# EAGLE design Smart Light Panel3 (EAGLE 7.5.0)
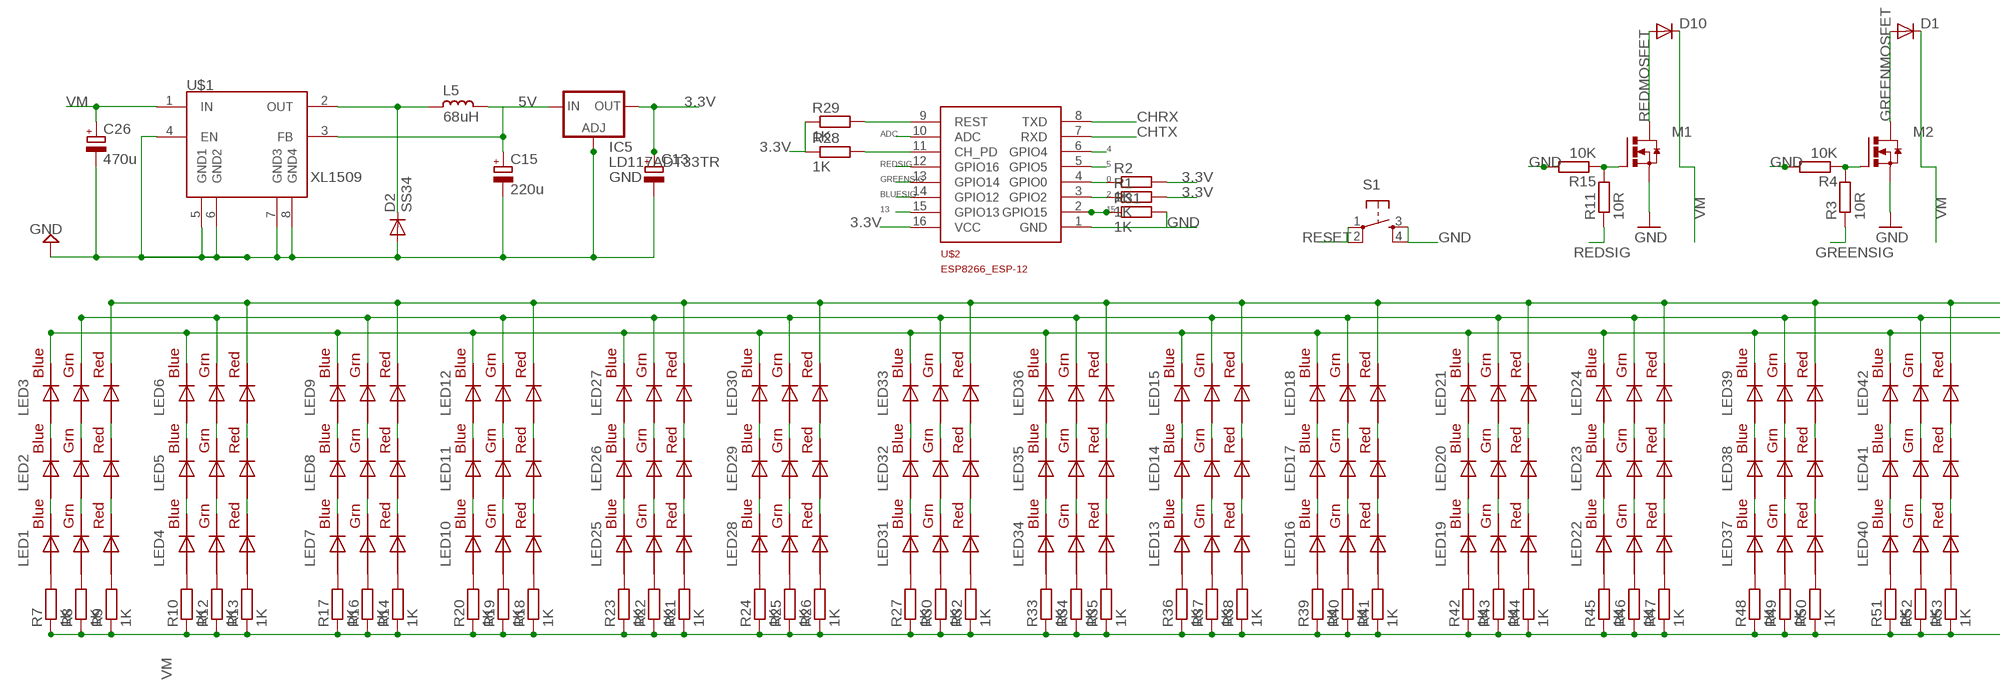
[diagram p0: schematic, sheet 1, part 1 of 2]
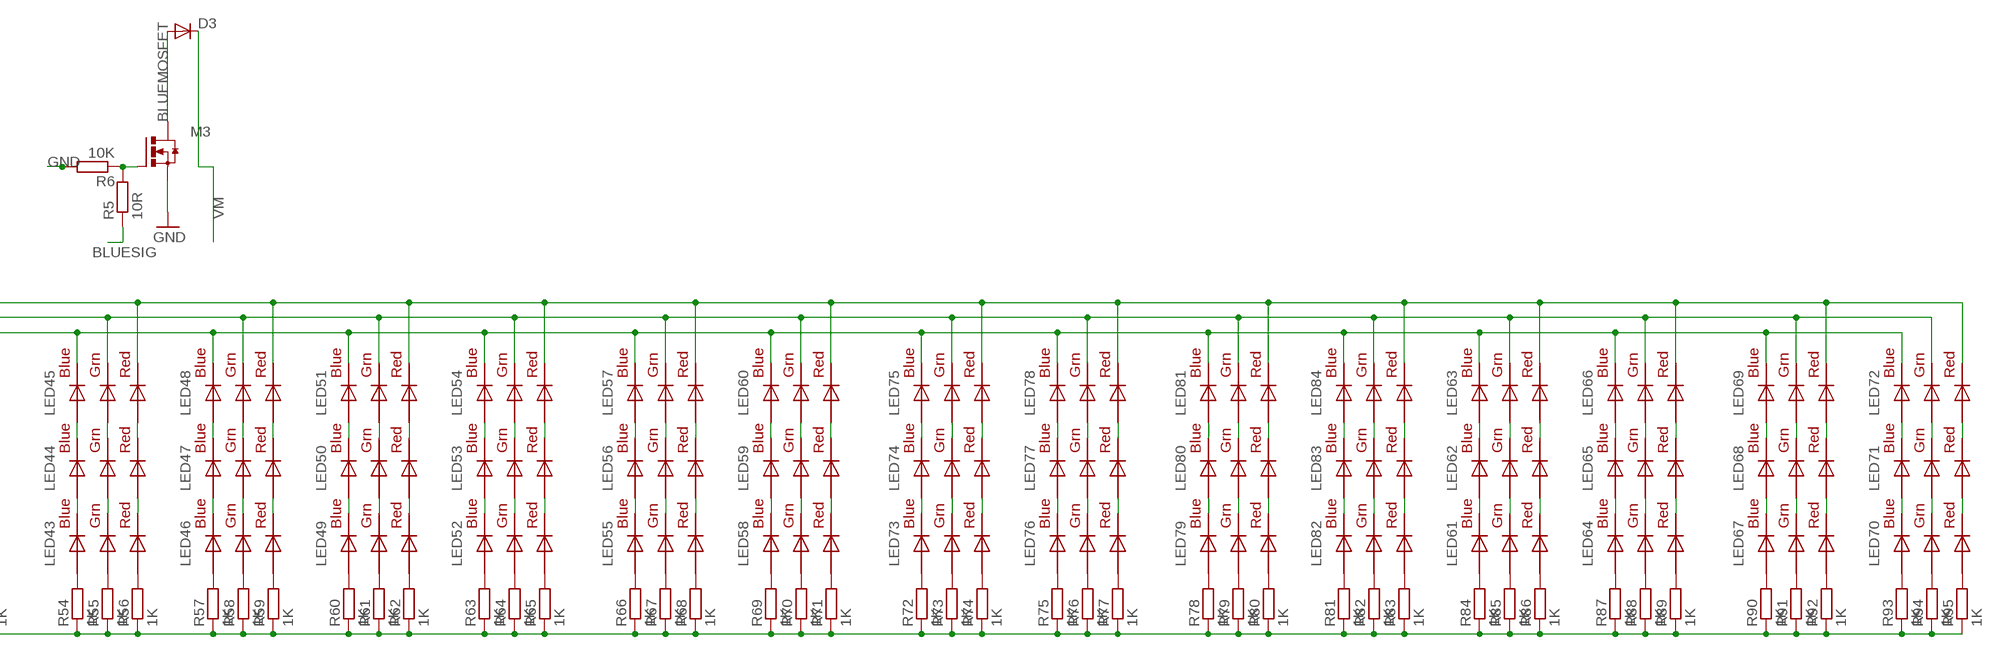
[diagram p1: schematic, sheet 1, part 2 of 2]

## Parts
C13  CPOL-EUE2.5-7  [E2,5-7]
C15  220u  CPOL-EUE2.5-7  [E2,5-7]
C26  470u  CPOL-EUE2.5-7  [E2,5-7]
D1  DIODESMA-ALT  [SMA-DIODE_ALT]
D2  SS34  DIODE-DO-214AC  [DO-214AC]
D3  DIODESMA-ALT  [SMA-DIODE_ALT]
D10  DIODESMA-ALT  [SMA-DIODE_ALT]
IC5  LD117ADT33TR  [DPACK]
L5  68uH  L_CD75  [CD75]
LED1  RGBLED5050  [RGBLED5050]
LED2  RGBLED5050  [RGBLED5050]
LED3  RGBLED5050  [RGBLED5050]
LED4  RGBLED5050  [RGBLED5050]
LED5  RGBLED5050  [RGBLED5050]
LED6  RGBLED5050  [RGBLED5050]
LED7  RGBLED5050  [RGBLED5050]
LED8  RGBLED5050  [RGBLED5050]
LED9  RGBLED5050  [RGBLED5050]
LED10  RGBLED5050  [RGBLED5050]
LED11  RGBLED5050  [RGBLED5050]
LED12  RGBLED5050  [RGBLED5050]
LED13  RGBLED5050  [RGBLED5050]
LED14  RGBLED5050  [RGBLED5050]
LED15  RGBLED5050  [RGBLED5050]
LED16  RGBLED5050  [RGBLED5050]
LED17  RGBLED5050  [RGBLED5050]
LED18  RGBLED5050  [RGBLED5050]
LED19  RGBLED5050  [RGBLED5050]
LED20  RGBLED5050  [RGBLED5050]
LED21  RGBLED5050  [RGBLED5050]
LED22  RGBLED5050  [RGBLED5050]
LED23  RGBLED5050  [RGBLED5050]
LED24  RGBLED5050  [RGBLED5050]
LED25  RGBLED5050  [RGBLED5050]
LED26  RGBLED5050  [RGBLED5050]
LED27  RGBLED5050  [RGBLED5050]
LED28  RGBLED5050  [RGBLED5050]
LED29  RGBLED5050  [RGBLED5050]
LED30  RGBLED5050  [RGBLED5050]
LED31  RGBLED5050  [RGBLED5050]
LED32  RGBLED5050  [RGBLED5050]
LED33  RGBLED5050  [RGBLED5050]
LED34  RGBLED5050  [RGBLED5050]
LED35  RGBLED5050  [RGBLED5050]
LED36  RGBLED5050  [RGBLED5050]
LED37  RGBLED5050  [RGBLED5050]
LED38  RGBLED5050  [RGBLED5050]
LED39  RGBLED5050  [RGBLED5050]
LED40  RGBLED5050  [RGBLED5050]
LED41  RGBLED5050  [RGBLED5050]
LED42  RGBLED5050  [RGBLED5050]
LED43  RGBLED5050  [RGBLED5050]
LED44  RGBLED5050  [RGBLED5050]
LED45  RGBLED5050  [RGBLED5050]
LED46  RGBLED5050  [RGBLED5050]
LED47  RGBLED5050  [RGBLED5050]
LED48  RGBLED5050  [RGBLED5050]
LED49  RGBLED5050  [RGBLED5050]
LED50  RGBLED5050  [RGBLED5050]
LED51  RGBLED5050  [RGBLED5050]
LED52  RGBLED5050  [RGBLED5050]
LED53  RGBLED5050  [RGBLED5050]
LED54  RGBLED5050  [RGBLED5050]
LED55  RGBLED5050  [RGBLED5050]
LED56  RGBLED5050  [RGBLED5050]
LED57  RGBLED5050  [RGBLED5050]
LED58  RGBLED5050  [RGBLED5050]
LED59  RGBLED5050  [RGBLED5050]
LED60  RGBLED5050  [RGBLED5050]
LED61  RGBLED5050  [RGBLED5050]
LED62  RGBLED5050  [RGBLED5050]
LED63  RGBLED5050  [RGBLED5050]
LED64  RGBLED5050  [RGBLED5050]
LED65  RGBLED5050  [RGBLED5050]
LED66  RGBLED5050  [RGBLED5050]
LED67  RGBLED5050  [RGBLED5050]
LED68  RGBLED5050  [RGBLED5050]
LED69  RGBLED5050  [RGBLED5050]
LED70  RGBLED5050  [RGBLED5050]
LED71  RGBLED5050  [RGBLED5050]
LED72  RGBLED5050  [RGBLED5050]
LED73  RGBLED5050  [RGBLED5050]
LED74  RGBLED5050  [RGBLED5050]
LED75  RGBLED5050  [RGBLED5050]
LED76  RGBLED5050  [RGBLED5050]
LED77  RGBLED5050  [RGBLED5050]
LED78  RGBLED5050  [RGBLED5050]
LED79  RGBLED5050  [RGBLED5050]
LED80  RGBLED5050  [RGBLED5050]
LED81  RGBLED5050  [RGBLED5050]
LED82  RGBLED5050  [RGBLED5050]
LED83  RGBLED5050  [RGBLED5050]
LED84  RGBLED5050  [RGBLED5050]
M1  IRLR024N  [TO252]
M2  IRLR024N  [TO252]
M3  IRLR024N  [TO252]
R1  1K  R-EU_M1206  [M1206]
R2  1K  R-EU_M1206  [M1206]
R3  10R  R-EU_M1206  [M1206]
R4  10K  R-EU_M1206  [M1206]
R5  10R  R-EU_M1206  [M1206]
R6  10K  R-EU_M1206  [M1206]
R7  1K  R-EU_R0603  [R0603]
R8  1K  R-EU_R0603  [R0603]
R9  1K  R-EU_R0603  [R0603]
R10  1K  R-EU_R0603  [R0603]
R11  10R  R-EU_M1206  [M1206]
R12  1K  R-EU_R0603  [R0603]
R13  1K  R-EU_R0603  [R0603]
R14  1K  R-EU_R0603  [R0603]
R15  10K  R-EU_M1206  [M1206]
R16  1K  R-EU_R0603  [R0603]
R17  1K  R-EU_R0603  [R0603]
R18  1K  R-EU_R0603  [R0603]
R19  1K  R-EU_R0603  [R0603]
R20  1K  R-EU_R0603  [R0603]
R21  1K  R-EU_R0603  [R0603]
R22  1K  R-EU_R0603  [R0603]
R23  1K  R-EU_R0603  [R0603]
R24  1K  R-EU_R0603  [R0603]
R25  1K  R-EU_R0603  [R0603]
R26  1K  R-EU_R0603  [R0603]
R27  1K  R-EU_R0603  [R0603]
R28  1K  R-EU_M1206  [M1206]
R29  1K  R-EU_M1206  [M1206]
R30  1K  R-EU_R0603  [R0603]
R31  1K  R-EU_M1206  [M1206]
R32  1K  R-EU_R0603  [R0603]
R33  1K  R-EU_R0603  [R0603]
R34  1K  R-EU_R0603  [R0603]
R35  1K  R-EU_R0603  [R0603]
R36  1K  R-EU_R0603  [R0603]
R37  1K  R-EU_R0603  [R0603]
R38  1K  R-EU_R0603  [R0603]
R39  1K  R-EU_R0603  [R0603]
R40  1K  R-EU_R0603  [R0603]
R41  1K  R-EU_R0603  [R0603]
R42  1K  R-EU_R0603  [R0603]
R43  1K  R-EU_R0603  [R0603]
R44  1K  R-EU_R0603  [R0603]
R45  1K  R-EU_R0603  [R0603]
R46  1K  R-EU_R0603  [R0603]
R47  1K  R-EU_R0603  [R0603]
R48  1K  R-EU_R0603  [R0603]
R49  1K  R-EU_R0603  [R0603]
R50  1K  R-EU_R0603  [R0603]
R51  1K  R-EU_R0603  [R0603]
R52  1K  R-EU_R0603  [R0603]
R53  1K  R-EU_R0603  [R0603]
R54  1K  R-EU_R0603  [R0603]
R55  1K  R-EU_R0603  [R0603]
R56  1K  R-EU_R0603  [R0603]
R57  1K  R-EU_R0603  [R0603]
R58  1K  R-EU_R0603  [R0603]
R59  1K  R-EU_R0603  [R0603]
R60  1K  R-EU_R0603  [R0603]
R61  1K  R-EU_R0603  [R0603]
R62  1K  R-EU_R0603  [R0603]
R63  1K  R-EU_R0603  [R0603]
R64  1K  R-EU_R0603  [R0603]
R65  1K  R-EU_R0603  [R0603]
R66  1K  R-EU_R0603  [R0603]
R67  1K  R-EU_R0603  [R0603]
R68  1K  R-EU_R0603  [R0603]
R69  1K  R-EU_R0603  [R0603]
R70  1K  R-EU_R0603  [R0603]
R71  1K  R-EU_R0603  [R0603]
R72  1K  R-EU_R0603  [R0603]
R73  1K  R-EU_R0603  [R0603]
R74  1K  R-EU_R0603  [R0603]
R75  1K  R-EU_R0603  [R0603]
R76  1K  R-EU_R0603  [R0603]
R77  1K  R-EU_R0603  [R0603]
R78  1K  R-EU_R0603  [R0603]
R79  1K  R-EU_R0603  [R0603]
R80  1K  R-EU_R0603  [R0603]
R81  1K  R-EU_R0603  [R0603]
R82  1K  R-EU_R0603  [R0603]
R83  1K  R-EU_R0603  [R0603]
R84  1K  R-EU_R0603  [R0603]
R85  1K  R-EU_R0603  [R0603]
R86  1K  R-EU_R0603  [R0603]
R87  1K  R-EU_R0603  [R0603]
R88  1K  R-EU_R0603  [R0603]
R89  1K  R-EU_R0603  [R0603]
R90  1K  R-EU_R0603  [R0603]
R91  1K  R-EU_R0603  [R0603]
R92  1K  R-EU_R0603  [R0603]
R93  1K  R-EU_R0603  [R0603]
R94  1K  R-EU_R0603  [R0603]
R95  1K  R-EU_R0603  [R0603]
S1  TAC_SWITCHPTH  [TACTILE-PTH]
U$1  XL1509  [SO08]
U$2  ESP8266_ESP-12  [ESP8266-ESP12]

## Nets
0: R2.1 U$2.4(GPIO0)
2: R1.1 U$2.3(GPIO2)
3.3V: C13.+ IC5.4(OUT) R1.2 R2.2 R28.1 R29.1 U$2.16(VCC)
4: U$2.6(GPIO4)
5: U$2.5(GPIO5)
5V: C15.+ IC5.3(IN) L5.1 U$1.3(FB)
13: U$2.15(GPIO13)
15: R31.1 U$2.2(GPIO15)
ADC: U$2.10(ADC)
BLUEMOSFET: D3.A LED3.4(BLUE_C) LED6.4(BLUE_C) LED9.4(BLUE_C) LED12.4(BLUE_C) LED15.4(BLUE_C) LED18.4(BLUE_C) LED21.4(BLUE_C) LED24.4(BLUE_C) LED27.4(BLUE_C) LED30.4(BLUE_C) LED33.4(BLUE_C) LED36.4(BLUE_C) LED39.4(BLUE_C) LED42.4(BLUE_C) LED45.4(BLUE_C) LED48.4(BLUE_C) LED51.4(BLUE_C) LED54.4(BLUE_C) LED57.4(BLUE_C) LED60.4(BLUE_C) LED63.4(BLUE_C) LED66.4(BLUE_C) LED69.4(BLUE_C) LED72.4(BLUE_C) LED75.4(BLUE_C) LED78.4(BLUE_C) LED81.4(BLUE_C) LED84.4(BLUE_C) M3.3(D)
BLUESIG: R5.1 U$2.14(GPIO12)
CHRX: U$2.8(TXD)
CHTX: U$2.7(RXD)
GND: C13.- C15.- C26.- D2.2(A) IC5.1(ADJ) M1.2(S) M2.2(S) M3.2(S) R4.2 R6.2 R15.2 R31.2 S1.3 S1.4 U$1.4(EN) U$1.5(GND1) U$1.6(GND2) U$1.7(GND3) U$1.8(GND4) U$2.1(GND)
GREENMOSFET: D1.A LED3.6(GREEN_C) LED6.6(GREEN_C) LED9.6(GREEN_C) LED12.6(GREEN_C) LED15.6(GREEN_C) LED18.6(GREEN_C) LED21.6(GREEN_C) LED24.6(GREEN_C) LED27.6(GREEN_C) LED30.6(GREEN_C) LED33.6(GREEN_C) LED36.6(GREEN_C) LED39.6(GREEN_C) LED42.6(GREEN_C) LED45.6(GREEN_C) LED48.6(GREEN_C) LED51.6(GREEN_C) LED54.6(GREEN_C) LED57.6(GREEN_C) LED60.6(GREEN_C) LED63.6(GREEN_C) LED66.6(GREEN_C) LED69.6(GREEN_C) LED72.6(GREEN_C) LED75.6(GREEN_C) LED78.6(GREEN_C) LED81.6(GREEN_C) LED84.6(GREEN_C) M2.3(D)
GREENSIG: R3.1 U$2.13(GPIO14)
N$1: M2.1(G) R3.2 R4.1
N$2: LED2.4(BLUE_C) LED3.3(BLUE_A)
N$3: LED2.6(GREEN_C) LED3.1(GREEN_A)
N$4: M3.1(G) R5.2 R6.1
N$5: LED59.4(BLUE_C) LED60.3(BLUE_A)
N$6: LED2.5(RED_C) LED3.2(RED_A)
N$7: LED1.5(RED_C) LED2.2(RED_A)
N$8: LED59.6(GREEN_C) LED60.1(GREEN_A)
N$10: LED59.5(RED_C) LED60.2(RED_A)
N$11: LED1.6(GREEN_C) LED2.1(GREEN_A)
N$14: LED1.4(BLUE_C) LED2.3(BLUE_A)
N$15: LED4.4(BLUE_C) LED5.3(BLUE_A)
N$16: LED4.6(GREEN_C) LED5.1(GREEN_A)
N$17: LED5.4(BLUE_C) LED6.3(BLUE_A)
N$18: R28.2 U$2.11(CH_PD)
N$19: LED5.6(GREEN_C) LED6.1(GREEN_A)
N$20: LED4.5(RED_C) LED5.2(RED_A)
N$21: LED5.5(RED_C) LED6.2(RED_A)
N$22: LED7.4(BLUE_C) LED8.3(BLUE_A)
N$23: LED8.4(BLUE_C) LED9.3(BLUE_A)
N$24: LED7.6(GREEN_C) LED8.1(GREEN_A)
N$25: LED8.6(GREEN_C) LED9.1(GREEN_A)
N$26: LED7.5(RED_C) LED8.2(RED_A)
N$27: LED8.5(RED_C) LED9.2(RED_A)
N$28: LED10.4(BLUE_C) LED11.3(BLUE_A)
N$29: LED11.4(BLUE_C) LED12.3(BLUE_A)
N$30: LED10.6(GREEN_C) LED11.1(GREEN_A)
N$31: LED11.6(GREEN_C) LED12.1(GREEN_A)
N$32: LED10.5(RED_C) LED11.2(RED_A)
N$33: LED11.5(RED_C) LED12.2(RED_A)
N$34: LED25.4(BLUE_C) LED26.3(BLUE_A)
N$35: LED26.4(BLUE_C) LED27.3(BLUE_A)
N$36: LED25.6(GREEN_C) LED26.1(GREEN_A)
N$37: LED26.6(GREEN_C) LED27.1(GREEN_A)
N$38: LED25.5(RED_C) LED26.2(RED_A)
N$39: LED26.5(RED_C) LED27.2(RED_A)
N$40: LED28.4(BLUE_C) LED29.3(BLUE_A)
N$41: LED28.6(GREEN_C) LED29.1(GREEN_A)
N$42: LED29.4(BLUE_C) LED30.3(BLUE_A)
N$43: LED29.6(GREEN_C) LED30.1(GREEN_A)
N$44: LED28.5(RED_C) LED29.2(RED_A)
N$45: LED29.5(RED_C) LED30.2(RED_A)
N$46: LED31.4(BLUE_C) LED32.3(BLUE_A)
N$47: LED32.4(BLUE_C) LED33.3(BLUE_A)
N$48: LED31.6(GREEN_C) LED32.1(GREEN_A)
N$49: LED32.6(GREEN_C) LED33.1(GREEN_A)
N$50: LED31.5(RED_C) LED32.2(RED_A)
N$51: LED32.5(RED_C) LED33.2(RED_A)
N$52: LED34.4(BLUE_C) LED35.3(BLUE_A)
N$53: LED35.4(BLUE_C) LED36.3(BLUE_A)
N$54: LED34.6(GREEN_C) LED35.1(GREEN_A)
N$55: LED35.6(GREEN_C) LED36.1(GREEN_A)
N$56: LED34.5(RED_C) LED35.2(RED_A)
N$57: LED35.5(RED_C) LED36.2(RED_A)
N$58: LED13.4(BLUE_C) LED14.3(BLUE_A)
N$59: LED13.6(GREEN_C) LED14.1(GREEN_A)
N$60: LED13.5(RED_C) LED14.2(RED_A)
N$61: LED14.5(RED_C) LED15.2(RED_A)
N$62: LED14.6(GREEN_C) LED15.1(GREEN_A)
N$63: LED14.4(BLUE_C) LED15.3(BLUE_A)
N$64: LED16.4(BLUE_C) LED17.3(BLUE_A)
N$65: LED16.6(GREEN_C) LED17.1(GREEN_A)
N$66: LED16.5(RED_C) LED17.2(RED_A)
N$67: M1.1(G) R11.2 R15.1
N$68: LED17.5(RED_C) LED18.2(RED_A)
N$69: LED17.6(GREEN_C) LED18.1(GREEN_A)
N$70: LED17.4(BLUE_C) LED18.3(BLUE_A)
N$71: LED19.4(BLUE_C) LED20.3(BLUE_A)
N$72: LED19.6(GREEN_C) LED20.1(GREEN_A)
N$73: LED19.5(RED_C) LED20.2(RED_A)
N$74: LED20.5(RED_C) LED21.2(RED_A)
N$75: LED20.6(GREEN_C) LED21.1(GREEN_A)
N$76: LED20.4(BLUE_C) LED21.3(BLUE_A)
N$77: LED22.4(BLUE_C) LED23.3(BLUE_A)
N$78: LED22.6(GREEN_C) LED23.1(GREEN_A)
N$79: LED22.5(RED_C) LED23.2(RED_A)
N$80: LED23.5(RED_C) LED24.2(RED_A)
N$81: LED23.6(GREEN_C) LED24.1(GREEN_A)
N$82: LED23.4(BLUE_C) LED24.3(BLUE_A)
N$83: LED37.4(BLUE_C) LED38.3(BLUE_A)
N$84: LED37.6(GREEN_C) LED38.1(GREEN_A)
N$85: LED37.5(RED_C) LED38.2(RED_A)
N$86: LED38.5(RED_C) LED39.2(RED_A)
N$87: LED38.6(GREEN_C) LED39.1(GREEN_A)
N$88: LED38.4(BLUE_C) LED39.3(BLUE_A)
N$89: LED40.5(RED_C) LED41.2(RED_A)
N$90: LED40.6(GREEN_C) LED41.1(GREEN_A)
N$91: LED40.4(BLUE_C) LED41.3(BLUE_A)
N$92: D2.1(C) L5.2 U$1.2(OUT)
N$93: LED41.4(BLUE_C) LED42.3(BLUE_A)
N$94: LED41.6(GREEN_C) LED42.1(GREEN_A)
N$95: LED41.5(RED_C) LED42.2(RED_A)
N$96: LED43.4(BLUE_C) LED44.3(BLUE_A)
N$97: LED43.6(GREEN_C) LED44.1(GREEN_A)
N$98: LED43.5(RED_C) LED44.2(RED_A)
N$99: LED44.5(RED_C) LED45.2(RED_A)
N$100: LED44.6(GREEN_C) LED45.1(GREEN_A)
N$101: LED44.4(BLUE_C) LED45.3(BLUE_A)
N$102: LED46.4(BLUE_C) LED47.3(BLUE_A)
N$103: LED46.6(GREEN_C) LED47.1(GREEN_A)
N$104: LED46.5(RED_C) LED47.2(RED_A)
N$105: LED47.5(RED_C) LED48.2(RED_A)
N$106: LED47.6(GREEN_C) LED48.1(GREEN_A)
N$107: LED47.4(BLUE_C) LED48.3(BLUE_A)
N$108: LED50.5(RED_C) LED51.2(RED_A)
N$109: LED50.6(GREEN_C) LED51.1(GREEN_A)
N$110: LED50.4(BLUE_C) LED51.3(BLUE_A)
N$111: LED49.4(BLUE_C) LED50.3(BLUE_A)
N$112: LED49.6(GREEN_C) LED50.1(GREEN_A)
N$113: LED49.5(RED_C) LED50.2(RED_A)
N$114: LED52.4(BLUE_C) LED53.3(BLUE_A)
N$115: LED52.6(GREEN_C) LED53.1(GREEN_A)
N$116: LED52.5(RED_C) LED53.2(RED_A)
N$117: LED53.5(RED_C) LED54.2(RED_A)
N$118: LED53.6(GREEN_C) LED54.1(GREEN_A)
N$119: LED53.4(BLUE_C) LED54.3(BLUE_A)
N$120: LED56.5(RED_C) LED57.2(RED_A)
N$121: LED56.6(GREEN_C) LED57.1(GREEN_A)
N$122: LED56.4(BLUE_C) LED57.3(BLUE_A)
N$123: LED55.4(BLUE_C) LED56.3(BLUE_A)
N$124: LED55.6(GREEN_C) LED56.1(GREEN_A)
N$125: LED55.5(RED_C) LED56.2(RED_A)
N$126: LED58.4(BLUE_C) LED59.3(BLUE_A)
N$127: LED58.6(GREEN_C) LED59.1(GREEN_A)
N$128: LED58.5(RED_C) LED59.2(RED_A)
N$129: LED73.4(BLUE_C) LED74.3(BLUE_A)
N$130: LED73.6(GREEN_C) LED74.1(GREEN_A)
N$131: LED73.5(RED_C) LED74.2(RED_A)
N$132: LED74.5(RED_C) LED75.2(RED_A)
N$133: LED74.6(GREEN_C) LED75.1(GREEN_A)
N$134: LED74.4(BLUE_C) LED75.3(BLUE_A)
N$135: LED76.4(BLUE_C) LED77.3(BLUE_A)
N$136: LED77.4(BLUE_C) LED78.3(BLUE_A)
N$137: LED77.6(GREEN_C) LED78.1(GREEN_A)
N$138: LED76.6(GREEN_C) LED77.1(GREEN_A)
N$139: LED76.5(RED_C) LED77.2(RED_A)
N$140: LED77.5(RED_C) LED78.2(RED_A)
N$141: LED80.4(BLUE_C) LED81.3(BLUE_A)
N$142: LED80.6(GREEN_C) LED81.1(GREEN_A)
N$143: LED80.5(RED_C) LED81.2(RED_A)
N$144: LED79.5(RED_C) LED80.2(RED_A)
N$145: LED79.6(GREEN_C) LED80.1(GREEN_A)
N$146: LED79.4(BLUE_C) LED80.3(BLUE_A)
N$147: LED82.4(BLUE_C) LED83.3(BLUE_A)
N$148: LED83.4(BLUE_C) LED84.3(BLUE_A)
N$149: LED83.6(GREEN_C) LED84.1(GREEN_A)
N$150: LED82.6(GREEN_C) LED83.1(GREEN_A)
N$151: LED82.5(RED_C) LED83.2(RED_A)
N$152: LED83.5(RED_C) LED84.2(RED_A)
N$153: LED62.4(BLUE_C) LED63.3(BLUE_A)
N$154: LED61.4(BLUE_C) LED62.3(BLUE_A)
N$155: LED61.6(GREEN_C) LED62.1(GREEN_A)
N$156: LED62.6(GREEN_C) LED63.1(GREEN_A)
N$157: LED62.5(RED_C) LED63.2(RED_A)
N$158: LED61.5(RED_C) LED62.2(RED_A)
N$159: LED65.4(BLUE_C) LED66.3(BLUE_A)
N$160: LED64.4(BLUE_C) LED65.3(BLUE_A)
N$161: LED65.6(GREEN_C) LED66.1(GREEN_A)
N$162: LED64.6(GREEN_C) LED65.1(GREEN_A)
N$163: LED64.5(RED_C) LED65.2(RED_A)
N$164: LED65.5(RED_C) LED66.2(RED_A)
N$165: LED67.4(BLUE_C) LED68.3(BLUE_A)
N$166: LED68.4(BLUE_C) LED69.3(BLUE_A)
N$167: LED68.6(GREEN_C) LED69.1(GREEN_A)
N$168: LED67.6(GREEN_C) LED68.1(GREEN_A)
N$169: LED67.5(RED_C) LED68.2(RED_A)
N$170: LED68.5(RED_C) LED69.2(RED_A)
N$171: LED71.4(BLUE_C) LED72.3(BLUE_A)
N$172: LED70.4(BLUE_C) LED71.3(BLUE_A)
N$173: LED70.6(GREEN_C) LED71.1(GREEN_A)
N$174: LED70.5(RED_C) LED71.2(RED_A)
N$175: LED71.5(RED_C) LED72.2(RED_A)
N$176: LED71.6(GREEN_C) LED72.1(GREEN_A)
N$177: LED1.3(BLUE_A) R7.2
N$178: LED1.1(GREEN_A) R8.2
N$179: LED1.2(RED_A) R9.2
N$180: LED4.3(BLUE_A) R10.2
N$181: LED4.1(GREEN_A) R12.2
N$182: LED4.2(RED_A) R13.2
N$183: LED7.2(RED_A) R14.2
N$184: LED7.1(GREEN_A) R16.2
N$185: LED7.3(BLUE_A) R17.2
N$186: LED10.2(RED_A) R18.2
N$187: LED10.1(GREEN_A) R19.2
N$188: LED10.3(BLUE_A) R20.2
N$189: LED25.2(RED_A) R21.2
N$190: LED25.1(GREEN_A) R22.2
N$191: LED25.3(BLUE_A) R23.2
N$192: LED28.3(BLUE_A) R24.2
N$193: LED28.1(GREEN_A) R25.2
N$194: LED28.2(RED_A) R26.2
N$195: LED31.3(BLUE_A) R27.2
N$196: LED31.1(GREEN_A) R30.2
N$197: LED31.2(RED_A) R32.2
N$198: LED34.3(BLUE_A) R33.2
N$199: LED34.1(GREEN_A) R34.2
N$200: LED34.2(RED_A) R35.2
N$201: LED13.3(BLUE_A) R36.2
N$202: LED13.1(GREEN_A) R37.2
N$203: LED13.2(RED_A) R38.2
N$204: LED16.3(BLUE_A) R39.2
N$205: LED16.1(GREEN_A) R40.2
N$206: LED16.2(RED_A) R41.2
N$207: LED19.3(BLUE_A) R42.2
N$208: LED19.1(GREEN_A) R43.2
N$209: LED19.2(RED_A) R44.2
N$210: LED22.3(BLUE_A) R45.2
N$211: LED22.1(GREEN_A) R46.2
N$212: LED22.2(RED_A) R47.2
N$213: LED37.3(BLUE_A) R48.2
N$214: LED37.1(GREEN_A) R49.2
N$215: LED37.2(RED_A) R50.2
N$216: LED40.3(BLUE_A) R51.2
N$217: LED40.1(GREEN_A) R52.2
N$218: LED40.2(RED_A) R53.2
N$219: LED43.3(BLUE_A) R54.2
N$220: LED43.1(GREEN_A) R55.2
N$221: LED43.2(RED_A) R56.2
N$222: LED46.3(BLUE_A) R57.2
N$223: LED46.1(GREEN_A) R58.2
N$224: LED46.2(RED_A) R59.2
N$225: LED49.3(BLUE_A) R60.2
N$226: LED49.1(GREEN_A) R61.2
N$227: LED49.2(RED_A) R62.2
N$228: LED52.3(BLUE_A) R63.2
N$229: LED52.1(GREEN_A) R64.2
N$230: LED52.2(RED_A) R65.2
N$231: LED55.3(BLUE_A) R66.2
N$232: LED55.1(GREEN_A) R67.2
N$233: LED55.2(RED_A) R68.2
N$234: LED58.3(BLUE_A) R69.2
N$235: LED58.1(GREEN_A) R70.2
N$236: LED58.2(RED_A) R71.2
N$237: LED73.3(BLUE_A) R72.2
N$238: LED73.1(GREEN_A) R73.2
N$239: LED73.2(RED_A) R74.2
N$240: LED76.3(BLUE_A) R75.2
N$241: LED76.1(GREEN_A) R76.2
N$242: LED76.2(RED_A) R77.2
N$243: LED79.3(BLUE_A) R78.2
N$244: LED79.1(GREEN_A) R79.2
N$245: LED79.2(RED_A) R80.2
N$246: LED82.3(BLUE_A) R81.2
N$247: LED82.1(GREEN_A) R82.2
N$248: LED82.2(RED_A) R83.2
N$249: LED61.3(BLUE_A) R84.2
N$250: LED61.1(GREEN_A) R85.2
N$251: LED61.2(RED_A) R86.2
N$252: LED64.3(BLUE_A) R87.2
N$253: LED64.1(GREEN_A) R88.2
N$254: LED64.2(RED_A) R89.2
N$255: LED67.3(BLUE_A) R90.2
N$256: LED67.1(GREEN_A) R91.2
N$257: LED67.2(RED_A) R92.2
N$258: LED70.3(BLUE_A) R93.2
N$259: LED70.1(GREEN_A) R94.2
N$260: LED70.2(RED_A) R95.2
REDMOSFET: D10.A LED3.5(RED_C) LED6.5(RED_C) LED9.5(RED_C) LED12.5(RED_C) LED15.5(RED_C) LED18.5(RED_C) LED21.5(RED_C) LED24.5(RED_C) LED27.5(RED_C) LED30.5(RED_C) LED33.5(RED_C) LED36.5(RED_C) LED39.5(RED_C) LED42.5(RED_C) LED45.5(RED_C) LED48.5(RED_C) LED51.5(RED_C) LED54.5(RED_C) LED57.5(RED_C) LED60.5(RED_C) LED63.5(RED_C) LED66.5(RED_C) LED69.5(RED_C) LED72.5(RED_C) LED75.5(RED_C) LED78.5(RED_C) LED81.5(RED_C) LED84.5(RED_C) M1.3(D)
REDSIG: R11.1 U$2.12(GPIO16)
RESET: R29.2 S1.1 S1.2 U$2.9(REST)
VM: C26.+ D1.C D3.C D10.C R7.1 R8.1 R9.1 R10.1 R12.1 R13.1 R14.1 R16.1 R17.1 R18.1 R19.1 R20.1 R21.1 R22.1 R23.1 R24.1 R25.1 R26.1 R27.1 R30.1 R32.1 R33.1 R34.1 R35.1 R36.1 R37.1 R38.1 R39.1 R40.1 R41.1 R42.1 R43.1 R44.1 R45.1 R46.1 R47.1 R48.1 R49.1 R50.1 R51.1 R52.1 R53.1 R54.1 R55.1 R56.1 R57.1 R58.1 R59.1 R60.1 R61.1 R62.1 R63.1 R64.1 R65.1 R66.1 R67.1 R68.1 R69.1 R70.1 R71.1 R72.1 R73.1 R74.1 R75.1 R76.1 R77.1 R78.1 R79.1 R80.1 R81.1 R82.1 R83.1 R84.1 R85.1 R86.1 R87.1 R88.1 R89.1 R90.1 R91.1 R92.1 R93.1 R94.1 R95.1 U$1.1(IN)

## Library data of the parts
C13 C15 C26 = rcl:CPOL-EU: POLARIZED CAPACITOR, European symbol
D1 D3 D10 = SparkFun-DiscreteSemi:DIODE: Diode These are standard reverse protection diodes and small signal diodes. SMA package can handle up to about 1A. SOD-323 can handle about 200mA. What the SOD-323 package when ordering, there are some mfgs out there that are 5-pin packages.
D2 = dp_devices:DIODE: Various Diode Packages
IC5 = v-reg:LD117A?*: Low drop fixed and adjustable positive voltage regulators 1 A Source: http://www.st.com/stonline/products/literature/ds/7194/ld1117axx.pdf
L5 = rc-master-smd:L_: INDUCTOR
LED1-LED84 = adafruit:RGBLED: For 5050 RGB LEDs, the order of the LEDs may vary from one manufacturer to another!
M1-M3 = to252(1):IRLR024N
R1 R2 R7-R10 R12-R14 R16-R95 = rcl:R-EU_: RESISTOR, European symbol
R3-R6 R11 R15 = resistor:R-EU_: RESISTOR, European symbol
S1 = SparkFun:TAC_SWITCH: Momentary Switch Button commonly used for reset or general input. Spark Fun Electronics SKU : COM-00097
U$1 = Cohesion_parts:XL1509
U$2 = ESP8266-ESP12:ESP8266_ESP-12: ESP8266 ESP-12 Discussion about pins here: http://www.esp8266.com/viewtopic.php?f=13&t=1429

## Net classes
1 power: width 0.6 mm, clearance 0.305 mm

## Board
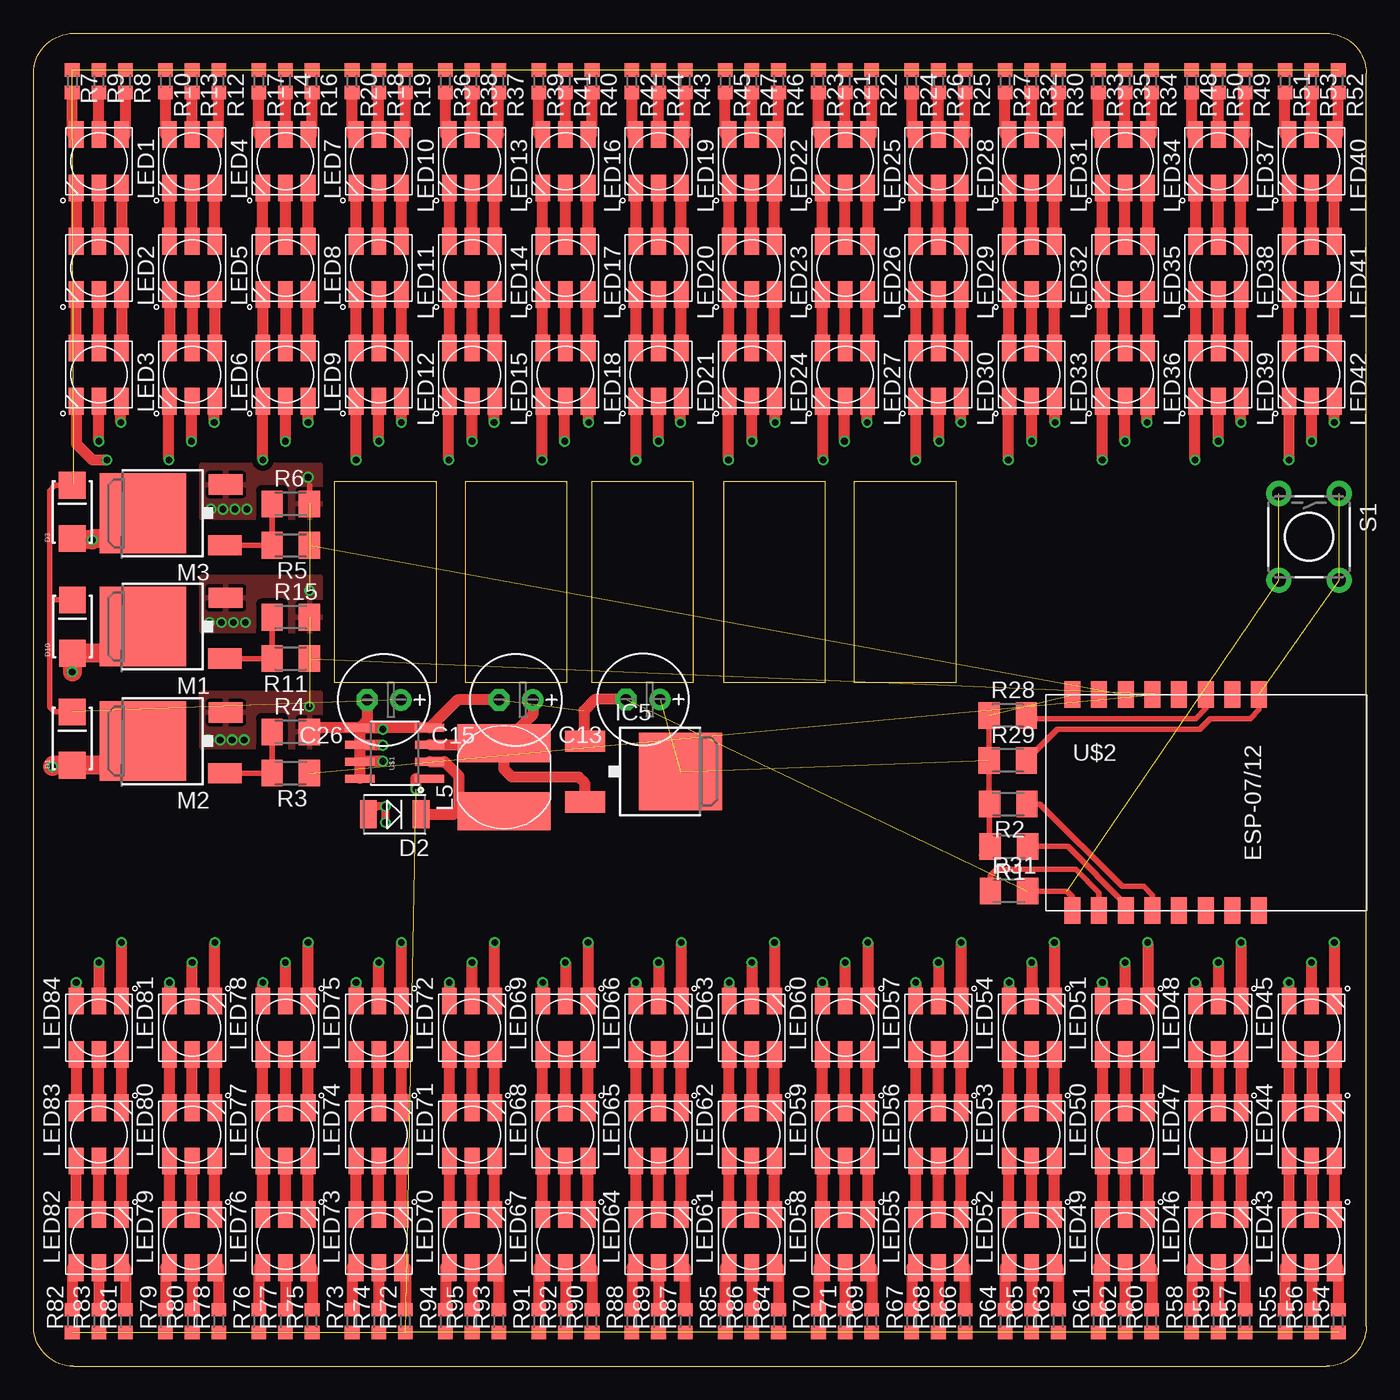
[diagram p2: board, top side]
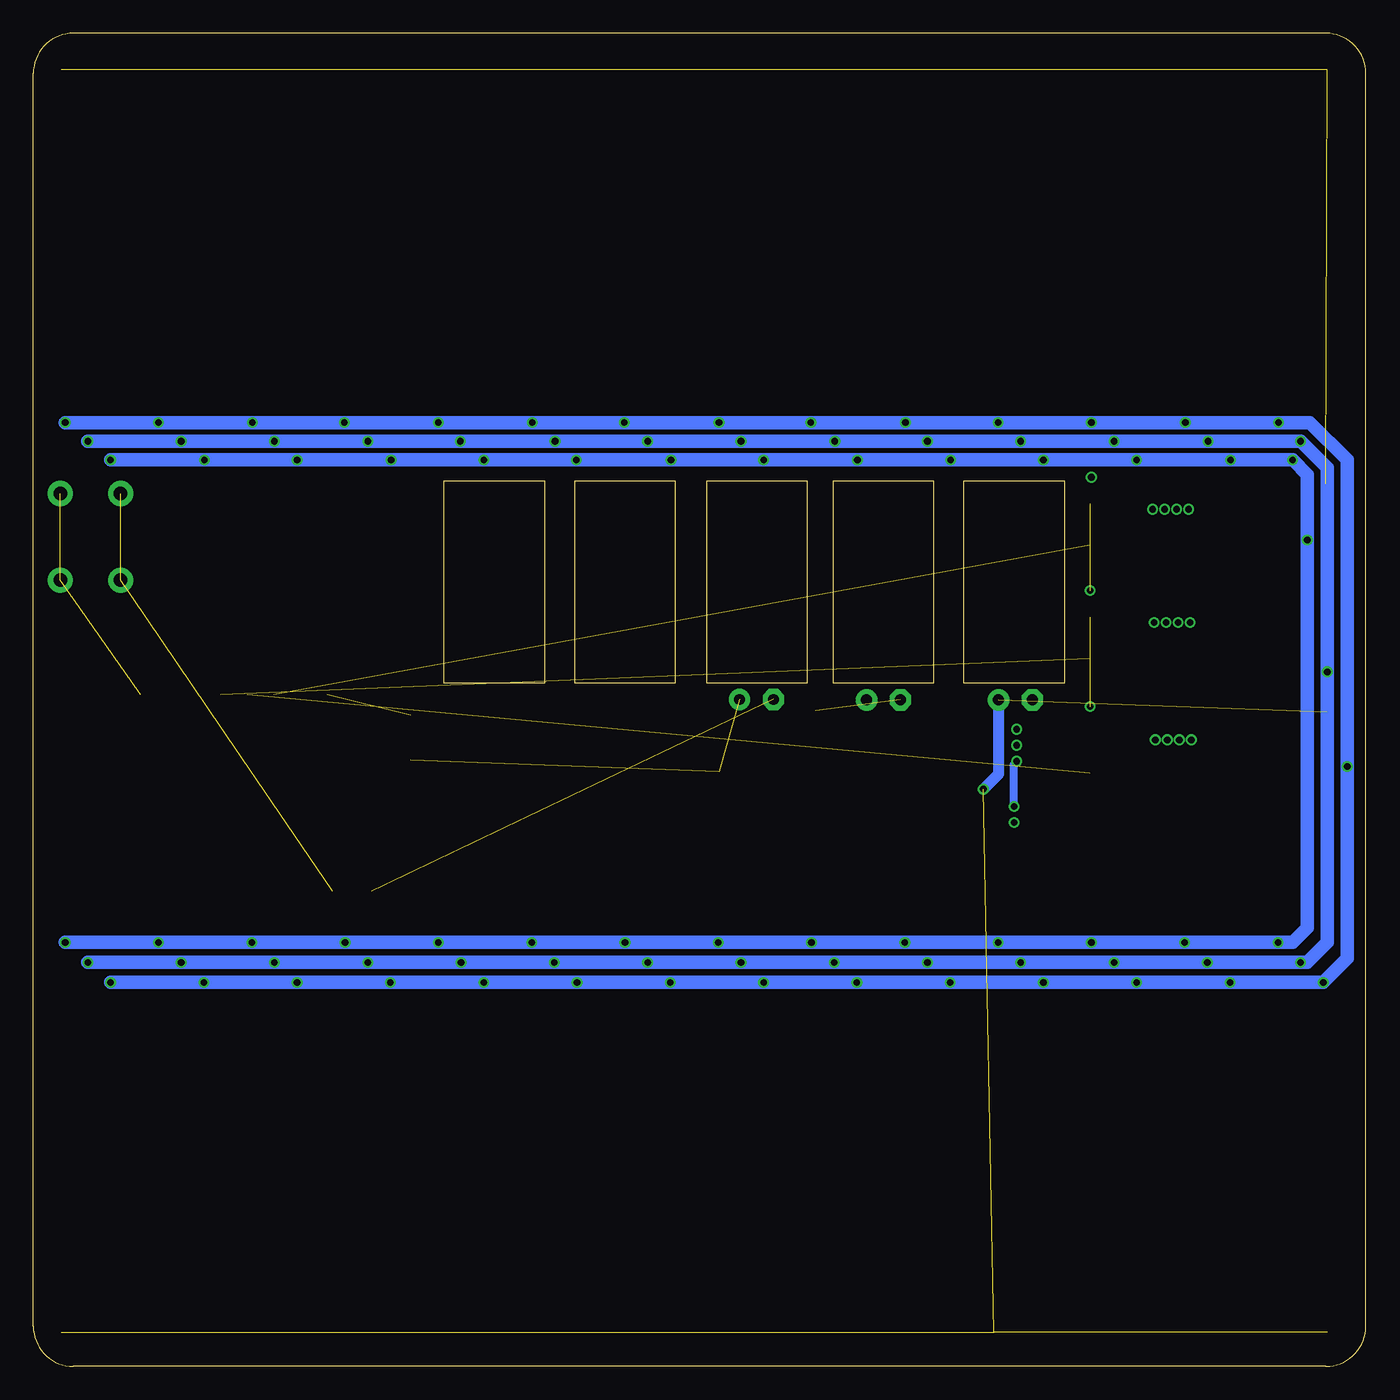
[diagram p3: board, bottom side, seen from below]

Size 100 x 100 mm. Coordinates in mm from the lower left corner, seen from the top.
Outline: 0,3 0,97 arc-90 3,100 97,100 arc-90 100,97 100,3 arc-90 97,0 3,0 arc-90 0,3
Outline: 32.4,66.4 40,66.4 40,51.3 32.4,51.3 32.4,66.4
Outline: 30.2,51.3 22.6,51.3 22.6,66.4 30.2,66.4 30.2,51.3
Outline: 41.9,66.4 49.5,66.4 49.5,51.3 41.9,51.3 41.9,66.4
Outline: 61.6,66.4 69.2,66.4 69.2,51.3 61.6,51.3 61.6,66.4
Outline: 59.4,51.3 51.8,51.3 51.8,66.4 59.4,66.4 59.4,51.3
Copper layers (1*16): Top 0.035mm / dielectric 1.5mm / Bottom 0.035mm
Design rules "dirt_cheap_dirty_boards.v1": minimum track width 5mil, minimum drill 12mil, track to track 5mil, track to pad 5mil, pad to pad 5mil, via to via 5mil, smd to smd 0mil, copper to edge 10mil, drill to drill 10mil, minimum pad ring 10mil, minimum via ring 6mil, stop-mask expansion 2mil, vias tented up to drill 25mil, thermal gap 10mil

### Footprints (pad centres in the part's own frame; a part is rotated, then mirrored left to right if it is on the bottom)
E2,5-7 = drill 0.813 pad 1.6: + -1.27,0 | drill 0.813 pad 1.6 octagon: - 1.27,0
SMA-DIODE_ALT = smd 2 x 2: A -2,0; C 2,0
DO-214AC = smd 1.27 x 2.1: 1 -1.98,0; 2 1.98,0
DPACK = smd 1.6 x 3: 1 -2.28,-4.8; 3 2.28,-4.8 | smd 5.8 x 6.2: 4 0,2.38
CD75 = smd 7 x 2.85: 1 0,2.54; 2 0,-2.54
RGBLED5050 = smd 2 x 1.1: 1 -2,1.7; 2 -2,0; 3 -2,-1.7; 4 2,-1.7; 5 2,0; 6 2,1.7
TO252 = smd 1.524 x 2.54: 1 -2.407,-3.657; 2 2.153,-3.72 | smd 5.97 x 6.48: 3 0,2.5
M1206 = smd 1.6 x 2: 1 -1.4,0; 2 1.4,0
R0603 = smd 1 x 1.1: 1 -0.85,0; 2 0.85,0
TACTILE-PTH = drill 1.016 pad 1.88: 1 -3.251,2.261; 2 3.251,2.261; 3 -3.251,-2.261; 4 3.251,-2.261
SO08 = smd 0.61 x 2.21: 1 -1.905,-2.616; 2 -0.635,-2.616; 3 0.635,-2.616; 4 1.905,-2.616; 5 1.905,2.616; 6 0.635,2.616; 7 -0.635,2.616; 8 -1.905,2.616
ESP8266-ESP12 = smd 2 x 1.2: 1 16.2,2; 2 16.2,4; 3 16.2,6; 4 16.2,8; 5 16.2,10; 6 16.2,12; 7 16.2,14; 8 16.2,16; 9 0,16; 10 0,14; 11 0,12; 12 0,10; 13 0,8; 14 0,6; 15 0,4; 16 0,2

### Placement (x,y rotation side)
C13  45.73,50.03 180 top
C15  36.2,50 180 top
C26  26.3,50 180 top
D1  2.9,47.1 90 top
D2  27.1,41.4 180 top
D3  2.9,64.1 90 top
D10  2.91,55.49 90 top
IC5  46.17,44.62 270 top
L5  35.3,44.2 0 top
LED1  4.9,90.4 270 top
LED2  4.9,82.4 270 top
LED3  4.9,74.4 270 top
LED4  11.9,90.4 270 top
LED5  11.9,82.4 270 top
LED6  11.9,74.4 270 top
LED7  18.9,90.4 270 top
LED8  18.9,82.4 270 top
LED9  18.9,74.4 270 top
LED10  25.9,90.4 270 top
LED11  25.9,82.4 270 top
LED12  25.9,74.4 270 top
LED13  32.9,90.4 270 top
LED14  32.9,82.4 270 top
LED15  32.9,74.4 270 top
LED16  39.9,90.4 270 top
LED17  39.9,82.4 270 top
LED18  39.9,74.4 270 top
LED19  46.9,90.4 270 top
LED20  46.9,82.4 270 top
LED21  46.9,74.4 270 top
LED22  53.9,90.4 270 top
LED23  53.9,82.4 270 top
LED24  53.9,74.4 270 top
LED25  60.9,90.4 270 top
LED26  60.9,82.4 270 top
LED27  60.9,74.4 270 top
LED28  67.9,90.4 270 top
LED29  67.9,82.4 270 top
LED30  67.9,74.4 270 top
LED31  74.9,90.4 270 top
LED32  74.9,82.4 270 top
LED33  74.9,74.4 270 top
LED34  81.9,90.4 270 top
LED35  81.9,82.4 270 top
LED36  81.9,74.4 270 top
LED37  88.9,90.4 270 top
LED38  88.9,82.4 270 top
LED39  88.9,74.4 270 top
LED40  95.9,90.4 270 top
LED41  95.9,82.4 270 top
LED42  95.9,74.4 270 top
LED43  95.9,9.4 90 top
LED44  95.9,17.4 90 top
LED45  95.9,25.4 90 top
LED46  88.9,9.4 90 top
LED47  88.9,17.4 90 top
LED48  88.9,25.4 90 top
LED49  81.9,9.4 90 top
LED50  81.9,17.4 90 top
LED51  81.9,25.4 90 top
LED52  74.9,9.4 90 top
LED53  74.9,17.4 90 top
LED54  74.9,25.4 90 top
LED55  67.9,9.4 90 top
LED56  67.9,17.4 90 top
LED57  67.9,25.4 90 top
LED58  60.9,9.4 90 top
LED59  60.9,17.4 90 top
LED60  60.9,25.4 90 top
LED61  53.9,9.4 90 top
LED62  53.9,17.4 90 top
LED63  53.9,25.4 90 top
LED64  46.9,9.4 90 top
LED65  46.9,17.4 90 top
LED66  46.9,25.4 90 top
LED67  39.9,9.4 90 top
LED68  39.9,17.4 90 top
LED69  39.9,25.4 90 top
LED70  32.9,9.4 90 top
LED71  32.9,17.4 90 top
LED72  32.9,25.4 90 top
LED73  25.9,9.4 90 top
LED74  25.9,17.4 90 top
LED75  25.9,25.4 90 top
LED76  18.9,9.4 90 top
LED77  18.9,17.4 90 top
LED78  18.9,25.4 90 top
LED79  11.9,9.4 90 top
LED80  11.9,17.4 90 top
LED81  11.9,25.4 90 top
LED82  4.9,9.4 90 top
LED83  4.9,17.4 90 top
LED84  4.9,25.4 90 top
M1  10.7,55.5 90 top
M2  10.7,46.9 90 top
M3  10.7,64 90 top
R1  73.19,39 180 top
R2  73.14,42.17 180 top
R3  19.3,44.5 180 top
R4  19.3,47.6 0 top
R5  19.3,61.6 180 top
R6  19.3,64.7 0 top
R7  2.9,96.4 270 top
R8  6.9,96.4 270 top
R9  4.9,96.4 270 top
R10  9.9,96.4 270 top
R11  19.3,53.1 180 top
R12  13.9,96.4 270 top
R13  11.9,96.4 270 top
R14  18.9,96.4 270 top
R15  19.3,56.2 0 top
R16  20.9,96.4 270 top
R17  16.9,96.4 270 top
R18  25.9,96.4 270 top
R19  27.9,96.4 270 top
R20  23.9,96.4 270 top
R21  60.9,96.4 270 top
R22  62.9,96.4 270 top
R23  58.9,96.4 270 top
R24  65.9,96.4 270 top
R25  69.9,96.4 270 top
R26  67.9,96.4 270 top
R27  72.9,96.4 270 top
R28  73.1,48.83 0 top
R29  73.1,45.46 0 top
R30  76.9,96.4 270 top
R31  73.19,35.66 0 top
R32  74.9,96.4 270 top
R33  79.9,96.4 270 top
R34  83.9,96.4 270 top
R35  81.9,96.4 270 top
R36  30.9,96.4 270 top
R37  34.9,96.4 270 top
R38  32.9,96.4 270 top
R39  37.9,96.4 270 top
R40  41.9,96.4 270 top
R41  39.9,96.4 270 top
R42  44.9,96.4 270 top
R43  48.9,96.4 270 top
R44  46.9,96.4 270 top
R45  51.9,96.4 270 top
R46  55.9,96.4 270 top
R47  53.9,96.4 270 top
R48  86.9,96.4 270 top
R49  90.9,96.4 270 top
R50  88.9,96.4 270 top
R51  93.9,96.4 270 top
R52  97.9,96.4 270 top
R53  95.9,96.4 270 top
R54  97.9,3.4 90 top
R55  93.9,3.4 90 top
R56  95.9,3.4 90 top
R57  90.9,3.4 90 top
R58  86.9,3.4 90 top
R59  88.9,3.4 90 top
R60  83.9,3.4 90 top
R61  79.9,3.4 90 top
R62  81.9,3.4 90 top
R63  76.9,3.4 90 top
R64  72.9,3.4 90 top
R65  74.9,3.4 90 top
R66  69.9,3.4 90 top
R67  65.9,3.4 90 top
R68  67.9,3.4 90 top
R69  62.9,3.4 90 top
R70  58.9,3.4 90 top
R71  60.9,3.4 90 top
R72  27.9,3.4 90 top
R73  23.9,3.4 90 top
R74  25.9,3.4 90 top
R75  20.9,3.4 90 top
R76  16.9,3.4 90 top
R77  18.9,3.4 90 top
R78  13.9,3.4 90 top
R79  9.9,3.4 90 top
R80  11.9,3.4 90 top
R81  6.9,3.4 90 top
R82  2.9,3.4 90 top
R83  4.9,3.4 90 top
R84  55.9,3.4 90 top
R85  51.9,3.4 90 top
R86  53.9,3.4 90 top
R87  48.9,3.4 90 top
R88  44.9,3.4 90 top
R89  46.9,3.4 90 top
R90  41.9,3.4 90 top
R91  37.9,3.4 90 top
R92  39.9,3.4 90 top
R93  34.9,3.4 90 top
R94  30.9,3.4 90 top
R95  32.9,3.4 90 top
S1  95.72,62.23 270 top
U$1  27.1,46 90 top
U$2  75.96,50.39 270 top

### Tracks (layer width: path | path; a pad name or v marks a point on that pad's centre or on a via)
0
  Top 0.406: U$2.4 83.96,35.34 83.3,36 81.7,36 75.53,42.17 R2.1
2
  Top 0.406: R1.1 77.6,39 81.96,34.64 U$2.3
3.3V  (3 unrouted)
  Top 0.406: R28.1 R29.1 71.7,42.22 R2.2 71.74,39.05 R1.2 71.14,38.35
5V
  Top 0.61: 35.2,46.63 L5.1
  Top 0.813: U$1.3 35.2,46.63 | C15.+ 37.47,48.91 L5.1 35.3,44.8 35.9,44.2 40.9,44.2 41.37,43.73 IC5.3
15
  Top 0.406: R31.1 71.8,36.8 72.3,37.3 78.2,37.3 79.96,35.54 U$2.2
BLUEMOSFET  (via drill 0.5)
  Top 0.813: LED84.4 v6.6,31.8 | v97.6,31.8 LED45.4 | LED81.4 v13.6,31.8 | LED78.4 v20.6,31.8 | LED75.4 v27.6,31.8 | LED72.4 v34.6,31.8 | v41.6,31.8 LED69.4 | v48.6,31.8 LED66.4 | v55.6,31.8 LED63.4 | v62.6,31.8 LED60.4 | v69.6,31.8 LED57.4 | v76.6,31.8 LED54.4 | v83.6,31.8 LED51.4 | v90.6,31.8 LED48.4 | LED42.4 v94.2,68 | v10.15,68 10.15,72.35 LED6.4 | v17.2,68 LED9.4 | v24.2,68 LED12.4 | v31.15,68 31.15,72.35 LED15.4 | v38.15,68 38.15,72.25 LED18.4 | v45.2,68 LED21.4 | v52.15,68 52.15,72.15 LED24.4 | v59.25,68 59.25,72.15 LED27.4 | v66.2,68 66.2,71.55 66.15,71.7 66.15,72.35 LED30.4 | v73.15,68 73.15,72.35 LED33.4 | v80.2,68 LED36.4 | v87.15,68 87.15,72.35 LED39.4 | LED3.4 3.2,69.2 4.4,68 v5.5,68
  Top 1.016: 3,62 D3.A | M3.3 8.1,64 | 4.5,62.1 v4.4,62
  Top 1.422: v4.4,62 3,62 | 8.1,64 6.2,62.1 4.5,62.1
  Bottom 1.016: v97.6,31.8 v90.6,31.8 v83.6,31.8 v76.6,31.8 v69.6,31.8 v62.6,31.8 v55.6,31.8 v48.6,31.8 v41.6,31.8 v34.6,31.8 v27.6,31.8 v20.6,31.8 v13.6,31.8 v6.6,31.8 5.5,31.8 4.4,32.9 v4.4,62 4.4,66.9 v5.5,68 v10.15,68 v17.2,68 v24.2,68 v31.15,68 v38.15,68 v45.2,68 v52.15,68 v59.25,68 v66.2,68 v73.15,68 v80.2,68 v87.15,68 v94.2,68
BLUESIG  (1 unrouted)
GND  (via drill 0.5)  (6 unrouted)
  Top 0.406: R31.2 77.54,35.66 77.96,35.24 U$2.1 | R6.2 20.7,66.1
  Top 0.61: 26.3,47.91 v26.2,47.8 26.09,47.91 | 24.52,45.4 U$1.7 | 24.52,46.6 U$1.6 | v26.4,40.8 v26.4,42 25.72,42 D2.2
  Top 0.813: 26.3,47.91 U$1.4 31.81,50 C15.- | U$1.5 26.09,47.91 | U$1.5 U$1.6 U$1.7 U$1.8 | v26.2,45.4 24.52,45.4 | v26.2,46.6 24.52,46.6 | C26.- 25.03,48.45 U$1.5 | C13.- 42.13,50.03 41.3,49.2 41.3,46.96 IC5.1 | U$1.5 21,47.91 R4.2
  Bottom 0.61: v26.2,45.4 26.4,45.2 v26.4,42 26.4,41.9
  other vias: 20.7,58.2 15.9,55.8 15,55.8 14.1,55.8 13.2,55.8 20.7,49.5 15.8,47 14.9,47 14,47 13.1,47 20.6,66.7 16,64.3 15.1,64.3 14.2,64.3 13.3,64.3
  pour Top (isolate 0.406): 12.6,67.6 12.6,63.7 21.5,63.7 21.5,67.6
  pour Top (isolate 0.406): 12.6,59.2 12.6,55.2 21.5,55.2 21.5,59.2
  pour Top (isolate 0.406): 12.6,50.5 12.6,46.5 21.5,46.5 21.5,50.5
GREENMOSFET  (via drill 0.5)
  Top 0.813: LED84.6 v3.2,28.8 | v94.2,28.8 LED45.6 | LED81.6 v10.2,28.8 | LED78.6 v17.2,28.8 | LED75.6 v24.2,28.8 | LED72.6 v31.2,28.8 | v38.2,28.8 LED69.6 | v45.2,28.8 LED66.6 | v52.2,28.8 LED63.6 | v59.2,28.8 LED60.6 | v66.2,28.8 LED57.6 | v73.2,28.8 LED54.6 | v80.2,28.8 LED51.6 | v87.2,28.8 LED48.6 | v97.6,70.8 LED42.6 | v6.55,70.8 6.55,72.25 LED3.6 | v13.55,70.8 13.55,72.35 LED6.6 | v20.6,70.8 LED9.6 | v27.6,70.8 LED12.6 | v34.55,70.8 34.55,72.35 LED15.6 | v41.65,70.8 41.65,72.35 LED18.6 | v48.55,70.8 48.55,72.15 LED21.6 | v55.65,70.8 55.65,72.15 LED24.6 | v62.55,70.8 62.55,72.35 LED27.6 | v69.6,70.8 LED30.6 | v76.65,70.8 76.65,72.35 LED33.6 | v83.55,70.8 83.55,72.35 LED36.6 | v90.6,70.8 LED39.6
  Top 1.016: M2.3 7.4,46.9 5.6,45.1
  Top 1.422: v1.4,45 1.5,45.1 D1.A 5.6,45.1
  Bottom 1.016: v3.2,28.8 v10.2,28.8 v17.2,28.8 v24.2,28.8 v31.2,28.8 v38.2,28.8 v45.2,28.8 v52.2,28.8 v59.2,28.8 v66.2,28.8 v73.2,28.8 v80.2,28.8 v87.2,28.8 v94.2,28.8 | v97.6,70.8 v90.6,70.8 v83.55,70.8 v76.65,70.8 v69.6,70.8 v62.55,70.8 v55.65,70.8 v48.55,70.8 v41.65,70.8 v34.55,70.8 v27.6,70.8 v20.6,70.8 v13.55,70.8 v6.55,70.8 4.2,70.8 1.4,68 v1.4,45 1.4,30.6 v3.2,28.8 | 3.9,28.8 v3.2,28.8
GREENSIG  (1 unrouted)
N$1
  Top 0.406: R4.1 R3.2 M2.1
N$2
  Top 0.813: LED3.3 LED2.4
N$3
  Top 0.813: LED2.6 LED3.1
N$4
  Top 0.406: R6.1 R5.2 M3.1
N$5
  Top 0.813: LED59.4 LED60.3
N$6
  Top 0.813: LED3.2 LED2.5
N$7
  Top 0.813: LED1.5 LED2.2
N$8
  Top 0.813: LED59.6 LED60.1
N$10
  Top 0.813: LED59.5 LED60.2
N$11
  Top 0.813: LED1.6 LED2.1
N$14
  Top 0.813: LED1.4 LED2.3
N$15
  Top 0.813: LED5.3 LED4.4
N$16
  Top 0.813: LED5.1 LED4.6
N$17
  Top 0.813: LED5.4 LED6.3
N$18
  Top 0.406: U$2.11 87.96,49.36 87.2,48.6 74.83,48.6 R28.2
N$19
  Top 0.813: LED5.6 LED6.1
N$20
  Top 0.813: LED5.2 LED4.5
N$21
  Top 0.813: LED5.5 LED6.2
N$22
  Top 0.813: LED8.3 LED7.4
N$23
  Top 0.813: LED8.4 LED9.3
N$24
  Top 0.813: LED8.1 LED7.6
N$25
  Top 0.813: LED9.1 LED8.6
N$26
  Top 0.813: LED8.2 LED7.5
N$27
  Top 0.813: LED8.5 LED9.2
N$28
  Top 0.813: LED11.3 LED10.4
N$29
  Top 0.813: LED12.3 LED11.4
N$30
  Top 0.813: LED11.1 LED10.6
N$31
  Top 0.813: LED12.1 LED11.6
N$32
  Top 0.813: LED11.2 LED10.5
N$33
  Top 0.813: LED12.2 LED11.5
N$34
  Top 0.813: LED26.3 LED25.4
N$35
  Top 0.813: LED27.3 LED26.4
N$36
  Top 0.813: LED26.1 LED25.6
N$37
  Top 0.813: LED27.1 LED26.6
N$38
  Top 0.813: LED26.2 LED25.5
N$39
  Top 0.813: LED27.2 LED26.5
N$40
  Top 0.813: LED29.3 LED28.4
N$41
  Top 0.813: LED29.1 LED28.6
N$42
  Top 0.813: LED30.3 LED29.4
N$43
  Top 0.813: LED30.1 LED29.6
N$44
  Top 0.813: LED29.2 LED28.5
N$45
  Top 0.813: LED30.2 LED29.5
N$46
  Top 0.813: LED32.3 LED31.4
N$47
  Top 0.813: LED33.3 LED32.4
N$48
  Top 0.813: LED32.1 LED31.6
N$49
  Top 0.813: LED33.1 LED32.6
N$50
  Top 0.813: LED32.2 LED31.5
N$51
  Top 0.813: LED33.2 LED32.5
N$52
  Top 0.813: LED35.3 LED34.4
N$53
  Top 0.813: LED36.3 LED35.4
N$54
  Top 0.813: LED35.1 LED34.6
N$55
  Top 0.813: LED36.1 LED35.6
N$56
  Top 0.813: LED35.2 LED34.5
N$57
  Top 0.813: LED36.2 LED35.5
N$58
  Top 0.813: LED14.3 LED13.4
N$59
  Top 0.813: LED14.1 LED13.6
N$60
  Top 0.813: LED14.2 LED13.5
N$61
  Top 0.813: LED15.2 LED14.5
N$62
  Top 0.813: LED15.1 LED14.6
N$63
  Top 0.813: LED15.3 LED14.4
N$64
  Top 0.813: LED17.3 LED16.4
N$65
  Top 0.813: LED17.1 LED16.6
N$66
  Top 0.813: LED17.2 LED16.5
N$67
  Top 0.406: R15.1 R11.2 M1.1
N$68
  Top 0.813: LED18.2 LED17.5
N$69
  Top 0.813: LED18.1 LED17.6
N$70
  Top 0.813: LED18.3 LED17.4
N$71
  Top 0.813: LED20.3 LED19.4
N$72
  Top 0.813: LED20.1 LED19.6
N$73
  Top 0.813: LED20.2 LED19.5
N$74
  Top 0.813: LED21.2 LED20.5
N$75
  Top 0.813: LED21.1 LED20.6
N$76
  Top 0.813: LED21.3 LED20.4
N$77
  Top 0.813: LED23.3 LED22.4
N$78
  Top 0.813: LED23.1 LED22.6
N$79
  Top 0.813: LED23.2 LED22.5
N$80
  Top 0.813: LED24.2 LED23.5
N$81
  Top 0.813: LED24.1 LED23.6
N$82
  Top 0.813: LED24.3 LED23.4
N$83
  Top 0.813: LED38.3 LED37.4
N$84
  Top 0.813: LED38.1 LED37.6
N$85
  Top 0.813: LED38.2 LED37.5
N$86
  Top 0.813: LED39.2 LED38.5
N$87
  Top 0.813: LED39.1 LED38.6
N$88
  Top 0.813: LED39.3 LED38.4
N$89
  Top 0.813: LED41.2 LED40.5
N$90
  Top 0.813: LED41.1 LED40.6
N$91
  Top 0.813: LED41.3 LED40.4
N$92
  Top 0.61: 31.9,41.8 32,41.7 | 35.26,41.7 L5.2
  Top 0.813: U$1.2 30.84,45.37 31.9,44.3 31.9,41.8 31.5,41.4 D2.1 | 32,41.7 35.26,41.7
N$93
  Top 0.813: LED42.3 LED41.4
N$94
  Top 0.813: LED42.1 LED41.6
N$95
  Top 0.813: LED42.2 LED41.5
N$96
  Top 0.813: LED44.3 LED43.4
N$97
  Top 0.813: LED44.1 LED43.6
N$98
  Top 0.813: LED44.2 LED43.5
N$99
  Top 0.813: LED45.2 LED44.5
N$100
  Top 0.813: LED45.1 LED44.6
N$101
  Top 0.813: LED45.3 LED44.4
N$102
  Top 0.813: LED47.3 LED46.4
N$103
  Top 0.813: LED47.1 LED46.6
N$104
  Top 0.813: LED47.2 LED46.5
N$105
  Top 0.813: LED48.2 LED47.5
N$106
  Top 0.813: LED48.1 LED47.6
N$107
  Top 0.813: LED48.3 LED47.4
N$108
  Top 0.813: LED51.2 LED50.5
N$109
  Top 0.813: LED51.1 LED50.6
N$110
  Top 0.813: LED51.3 LED50.4
N$111
  Top 0.813: LED50.3 LED49.4
N$112
  Top 0.813: LED50.1 LED49.6
N$113
  Top 0.813: LED50.2 LED49.5
N$114
  Top 0.813: LED52.4 LED53.3
N$115
  Top 0.813: LED52.6 LED53.1
N$116
  Top 0.813: LED52.5 LED53.2
N$117
  Top 0.813: LED53.5 LED54.2
N$118
  Top 0.813: LED53.6 LED54.1
N$119
  Top 0.813: LED53.4 LED54.3
N$120
  Top 0.813: LED56.5 LED57.2
N$121
  Top 0.813: LED56.6 LED57.1
N$122
  Top 0.813: LED56.4 LED57.3
N$123
  Top 0.813: LED55.4 LED56.3
N$124
  Top 0.813: LED55.6 LED56.1
N$125
  Top 0.813: LED55.5 LED56.2
N$126
  Top 0.813: LED58.4 LED59.3
N$127
  Top 0.813: LED58.6 LED59.1
N$128
  Top 0.813: LED58.5 LED59.2
N$129
  Top 0.813: LED73.4 LED74.3
N$130
  Top 0.813: LED73.6 LED74.1
N$131
  Top 0.813: LED73.5 LED74.2
N$132
  Top 0.813: LED74.5 LED75.2
N$133
  Top 0.813: LED74.6 LED75.1
N$134
  Top 0.813: LED74.4 LED75.3
N$135
  Top 0.813: LED76.4 LED77.3
N$136
  Top 0.813: LED77.4 LED78.3
N$137
  Top 0.813: LED77.6 LED78.1
N$138
  Top 0.813: LED76.6 LED77.1
N$139
  Top 0.813: LED76.5 LED77.2
N$140
  Top 0.813: LED77.5 LED78.2
N$141
  Top 0.813: LED80.4 LED81.3
N$142
  Top 0.813: LED80.6 LED81.1
N$143
  Top 0.813: LED80.5 LED81.2
N$144
  Top 0.813: LED79.5 LED80.2
N$145
  Top 0.813: LED79.6 LED80.1
N$146
  Top 0.813: LED79.4 LED80.3
N$147
  Top 0.813: LED82.4 LED83.3
N$148
  Top 0.813: LED83.4 LED84.3
N$149
  Top 0.813: LED84.1 LED83.6
N$150
  Top 0.813: LED82.6 LED83.1
N$151
  Top 0.813: LED82.5 LED83.2
N$152
  Top 0.813: LED83.5 LED84.2
N$153
  Top 0.813: LED62.4 LED63.3
N$154
  Top 0.813: LED61.4 LED62.3
N$155
  Top 0.813: LED61.6 LED62.1
N$156
  Top 0.813: LED62.6 LED63.1
N$157
  Top 0.813: LED62.5 LED63.2
N$158
  Top 0.813: LED61.5 LED62.2
N$159
  Top 0.813: LED65.4 LED66.3
N$160
  Top 0.813: LED64.4 LED65.3
N$161
  Top 0.813: LED65.6 LED66.1
N$162
  Top 0.813: LED64.6 LED65.1
N$163
  Top 0.813: LED64.5 LED65.2
N$164
  Top 0.813: LED65.5 LED66.2
N$165
  Top 0.813: LED67.4 LED68.3
N$166
  Top 0.813: LED68.4 LED69.3
N$167
  Top 0.813: LED68.6 LED69.1
N$168
  Top 0.813: LED67.6 LED68.1
N$169
  Top 0.813: LED67.5 LED68.2
N$170
  Top 0.813: LED68.5 LED69.2
N$171
  Top 0.813: LED71.4 LED72.3
N$172
  Top 0.813: LED70.4 LED71.3
N$173
  Top 0.813: LED70.6 LED71.1
N$174
  Top 0.813: LED70.5 LED71.2
N$175
  Top 0.813: LED71.5 LED72.2
N$176
  Top 0.813: LED71.6 LED72.1
N$177
  Top 0.813: LED1.3 2.9,92.4 R7.2
N$178
  Top 0.813: LED1.1 6.9,92.4 R8.2
N$179
  Top 0.813: LED1.2 R9.2
N$180
  Top 0.813: LED4.3 9.9,92.4 R10.2
N$181
  Top 0.813: LED4.1 13.9,92.4 R12.2
N$182
  Top 0.813: LED4.2 R13.2
N$183
  Top 0.813: LED7.2 R14.2
N$184
  Top 0.813: LED7.1 20.9,92.4 R16.2
N$185
  Top 0.813: LED7.3 16.9,92.4 R17.2
N$186
  Top 0.813: LED10.2 R18.2
N$187
  Top 0.813: LED10.1 27.9,92.4 R19.2
N$188
  Top 0.813: LED10.3 23.9,92.4 R20.2
N$189
  Top 0.813: LED25.2 R21.2
N$190
  Top 0.813: LED25.1 62.9,92.4 R22.2
N$191
  Top 0.813: LED25.3 58.9,92.4 R23.2
N$192
  Top 0.813: LED28.3 65.9,92.4 R24.2
N$193
  Top 0.813: LED28.1 69.9,92.4 R25.2
N$194
  Top 0.813: LED28.2 R26.2
N$195
  Top 0.813: LED31.3 72.9,92.4 R27.2
N$196
  Top 0.813: LED31.1 76.9,92.4 R30.2
N$197
  Top 0.813: LED31.2 R32.2
N$198
  Top 0.813: LED34.3 79.9,92.4 R33.2
N$199
  Top 0.813: LED34.1 83.9,92.4 R34.2
N$200
  Top 0.813: LED34.2 R35.2
N$201
  Top 0.813: LED13.3 30.9,92.4 R36.2
N$202
  Top 0.813: LED13.1 34.9,92.4 R37.2
N$203
  Top 0.813: LED13.2 R38.2
N$204
  Top 0.813: LED16.3 37.9,92.4 R39.2
N$205
  Top 0.813: LED16.1 41.9,92.4 R40.2
N$206
  Top 0.813: LED16.2 R41.2
N$207
  Top 0.813: LED19.3 44.9,92.4 R42.2
N$208
  Top 0.813: LED19.1 48.9,92.4 R43.2
N$209
  Top 0.813: LED19.2 R44.2
N$210
  Top 0.813: LED22.3 51.9,92.4 R45.2
N$211
  Top 0.813: LED22.1 55.9,92.4 R46.2
N$212
  Top 0.813: LED22.2 R47.2
N$213
  Top 0.813: LED37.3 86.9,92.4 R48.2
N$214
  Top 0.813: LED37.1 90.9,92.4 R49.2
N$215
  Top 0.813: LED37.2 R50.2
N$216
  Top 0.813: LED40.3 93.9,92.4 R51.2
N$217
  Top 0.813: LED40.1 97.9,92.4 R52.2
N$218
  Top 0.813: LED40.2 R53.2
N$219
  Top 0.813: LED43.3 97.9,7.4 R54.2
N$220
  Top 0.813: LED43.1 93.9,7.4 R55.2
N$221
  Top 0.813: LED43.2 R56.2
N$222
  Top 0.813: LED46.3 90.9,7.4 R57.2
N$223
  Top 0.813: LED46.1 86.9,7.4 R58.2
N$224
  Top 0.813: LED46.2 R59.2
N$225
  Top 0.813: LED49.3 83.9,7.4 R60.2
N$226
  Top 0.813: LED49.1 79.9,7.4 R61.2
N$227
  Top 0.813: LED49.2 R62.2
N$228
  Top 0.813: LED52.3 76.9,7.4 R63.2
N$229
  Top 0.813: LED52.1 72.9,7.4 R64.2
N$230
  Top 0.813: LED52.2 R65.2
N$231
  Top 0.813: LED55.3 69.9,7.4 R66.2
N$232
  Top 0.813: LED55.1 65.9,7.4 R67.2
N$233
  Top 0.813: LED55.2 R68.2
N$234
  Top 0.813: LED58.3 62.9,7.4 R69.2
N$235
  Top 0.813: LED58.1 58.9,7.4 R70.2
N$236
  Top 0.813: LED58.2 R71.2
N$237
  Top 0.813: LED73.3 27.9,7.4 R72.2
N$238
  Top 0.813: LED73.1 23.9,7.4 R73.2
N$239
  Top 0.813: LED73.2 R74.2
N$240
  Top 0.813: LED76.3 20.9,7.4 R75.2
N$241
  Top 0.813: LED76.1 16.9,7.4 R76.2
N$242
  Top 0.813: LED76.2 R77.2
N$243
  Top 0.813: LED79.3 13.9,7.4 R78.2
N$244
  Top 0.813: LED79.1 9.9,7.4 R79.2
N$245
  Top 0.813: LED79.2 R80.2
N$246
  Top 0.813: LED82.3 6.9,7.4 R81.2
N$247
  Top 0.813: LED82.1 2.9,7.4 R82.2
N$248
  Top 0.813: LED82.2 R83.2
N$249
  Top 0.813: LED61.3 55.9,7.4 R84.2
N$250
  Top 0.813: LED61.1 51.9,7.4 R85.2
N$251
  Top 0.813: LED61.2 R86.2
N$252
  Top 0.813: LED64.3 48.9,7.4 R87.2
N$253
  Top 0.813: LED64.1 44.9,7.4 R88.2
N$254
  Top 0.813: LED64.2 R89.2
N$255
  Top 0.813: LED67.3 41.9,7.4 R90.2
N$256
  Top 0.813: LED67.1 37.9,7.4 R91.2
N$257
  Top 0.813: LED67.2 R92.2
N$258
  Top 0.813: LED70.3 34.9,7.4 R93.2
N$259
  Top 0.813: LED70.1 30.9,7.4 R94.2
N$260
  Top 0.813: LED70.2 R95.2
REDMOSFET  (via drill 0.5)
  Top 0.813: LED45.5 v95.9,30.3 | v4.9,30.3 LED84.5 | LED81.5 v11.9,30.3 | LED78.5 v18.9,30.3 | LED75.5 v25.9,30.3 | LED72.5 v32.9,30.3 | v39.9,30.3 LED69.5 | v46.9,30.3 LED66.5 | v53.9,30.3 LED63.5 | v60.9,30.3 LED60.5 | v67.9,30.3 LED57.5 | v74.9,30.3 LED54.5 | v81.9,30.3 LED51.5 | v88.9,30.3 LED48.5 | v95.9,69.4 LED42.5 | v4.9,69.4 LED3.5 | v11.85,69.4 11.85,72.25 LED6.5 | v18.9,69.4 LED9.5 | v25.9,69.4 LED12.5 | v32.9,69.4 LED15.5 | v39.85,69.4 39.85,72.25 LED18.5 | v46.9,69.4 LED21.5 | v53.9,69.4 LED24.5 | v60.85,69.4 60.85,72.15 LED27.5 | v67.95,69.4 67.95,72.35 LED30.5 | v74.9,69.4 LED33.5 | v81.9,69.4 LED36.5 | v88.9,69.4 LED39.5
  Top 1.016: v2.91,52.11 v2.9,52.1 | M1.3 6.2,53.5 | D10.A
  Top 1.422: D10.A v2.91,52.11 | 6.2,53.5 D10.A
  Bottom 1.016: v95.9,30.3 v88.9,30.3 v81.9,30.3 v74.9,30.3 v67.9,30.3 v60.9,30.3 v53.9,30.3 v46.9,30.3 v39.9,30.3 v32.9,30.3 v25.9,30.3 v18.9,30.3 v11.9,30.3 v4.9,30.3 4.4,30.3 2.9,31.8 v2.9,52.1 2.9,67.4 v4.9,69.4 v11.85,69.4 v18.9,69.4 v25.9,69.4 v32.9,69.4 v39.85,69.4 v46.9,69.4 v53.9,69.4 v60.85,69.4 v67.95,69.4 v74.9,69.4 v81.9,69.4 v88.9,69.4 v95.9,69.4
REDSIG  (1 unrouted)
RESET  (2 unrouted)
  Top 0.406: U$2.9 91.96,49.26 91.3,48.6 88.3,48.6 87.5,47.8 76.84,47.8 R29.2
VM  (via drill 0.5)  (85 unrouted)
  Top 0.406: D3.C 1.6,66.1 1.2,65.7 1.2,57.5 | 1.2,57.5 1.2,49.5 1.6,49.1 D1.C | D10.C 1.21,57.49 1.2,57.5
  Top 0.61: 3,66.2 D3.C | U$1.1 28.7,44.09
  Top 0.813: v28.7,43.3 28.7,44.09
  Bottom 0.813: C26.+ 27.57,44.43 v28.7,43.3